# Altium schematic sheet sensor.SchDoc
size A4
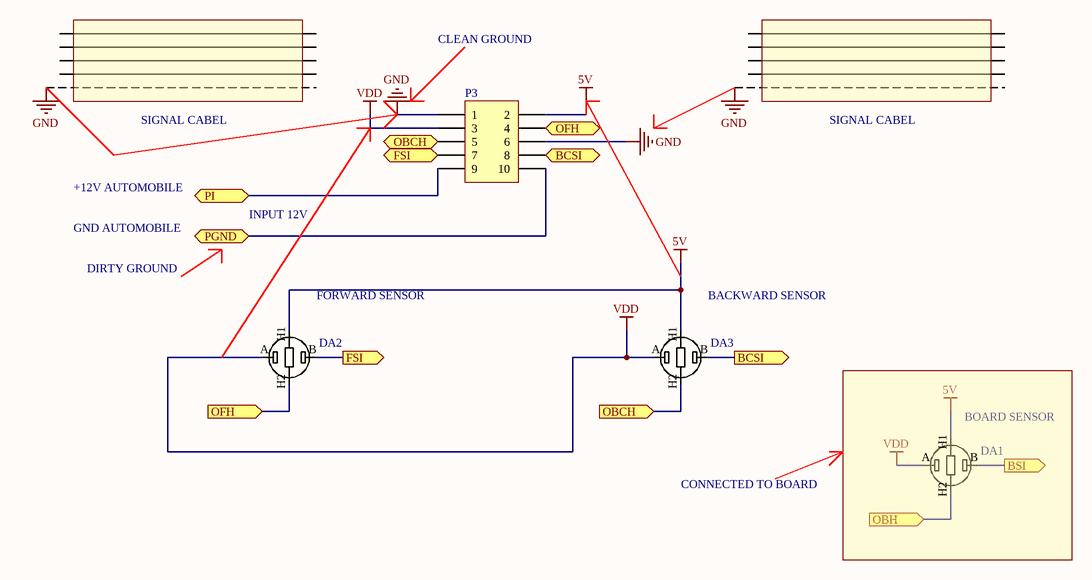
[diagram p0: sensor.SchDoc]

## Parts
DA1  Gas sensor MQ4  [MQ1]  (value not drawn)
DA2  Gas sensor MQ4  [MQ1]  (value not drawn)
DA3  Gas sensor MQ4  [MQ1]  (value not drawn)
P3  Header 5X2  [HDR2X5]  (value not drawn)

## Blocks framed on the sheet
BOARD SENSOR: DA1

## Ports
BCSI (out), BSI (out), FSI (out), OBCH (in), OBCH (out), OBH (in), OFH (in), OFH (out), PGND (bidir), PI (bidir)

## Nets
5V: DA1.H1 DA2.H1 DA3.H1 P3.2
GND: P3.1 P3.6
VDD: DA1.A DA2.A DA3.A P3.3
BCSI: DA3.B P3.8 ; port BCSI
BSI: DA1.B ; port BSI
FSI: DA2.B P3.7 ; port FSI
OBCH: DA3.H2 P3.5 ; port OBCH
OBH: DA1.H2 ; port OBH
OFH: DA2.H2 P3.4 ; port OFH
PGND: P3.10 ; port PGND
PI: P3.9 ; port PI

## Notes on the sheet
- CLEAN GROUND
- SIGNAL CABEL
- +12V AUTOMOBILE
- GND AUTOMOBILE
- INPUT 12V
- DIRTY GROUND
- (near DA2) FORWARD SENSOR
- (near DA3) BACKWARD SENSOR
- CONNECTED TO BOARD
- Labels drawn without touching a wire or pin: GND

## Library data of the parts
DA1-DA3 = MQ1
P3 = Header 5X2: Header, 5-Pin, Dual row; LatestRevisionDate: 17-Jul-2002; LatestRevisionNote: Re-released for DXP Platform.; Publisher: Altium Limited